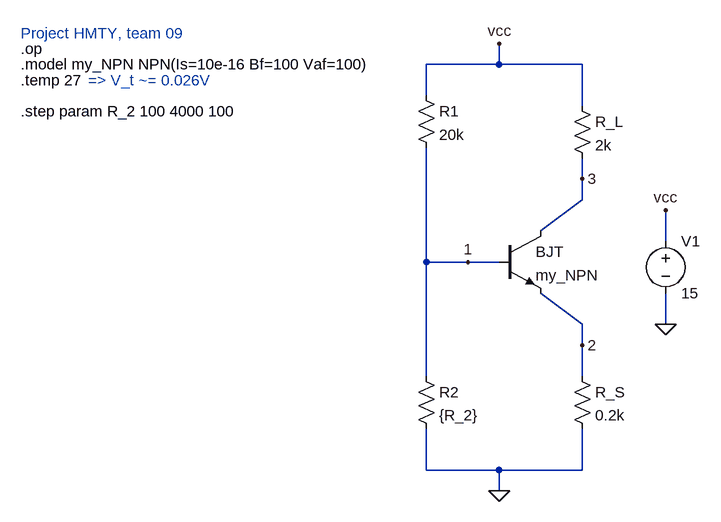
[diagram p0: schematic bjt.asc]
bjt.asc, the LTspice schematic file:
Version 4
SHEET 1 880 680
WIRE 512 -112 512 -144
WIRE 512 -112 400 -112
WIRE 640 -112 512 -112
WIRE 400 -64 400 -112
WIRE 640 -48 640 -112
WIRE 640 64 640 32
WIRE 640 96 640 64
WIRE 576 144 640 96
WIRE 768 160 768 112
WIRE 400 192 400 16
WIRE 464 192 400 192
WIRE 512 192 464 192
WIRE 640 288 576 240
WIRE 768 288 768 240
WIRE 640 320 640 288
WIRE 400 368 400 192
WIRE 640 368 640 320
WIRE 400 512 400 448
WIRE 512 512 400 512
WIRE 640 512 640 448
WIRE 640 512 512 512
WIRE 512 544 512 512
FLAG 512 -144 vcc
FLAG 512 544 0
FLAG 768 288 0
FLAG 768 112 vcc
FLAG 640 320 2
FLAG 640 64 3
FLAG 464 192 1
SYMBOL npn 512 144 R0
SYMATTR InstName BJT
SYMATTR Value my_NPN
SYMBOL res 384 -80 R0
SYMATTR InstName R1
SYMATTR Value 20k
SYMBOL res 384 352 R0
SYMATTR InstName R2
SYMATTR Value {R_2}
SYMBOL res 624 -64 R0
SYMATTR InstName R_L
SYMATTR Value 2k
SYMBOL res 624 352 R0
SYMATTR InstName R_S
SYMATTR Value 0.2k
SYMBOL voltage 768 144 R0
WINDOW 123 0 0 Left 0
WINDOW 39 0 0 Left 0
SYMATTR InstName V1
SYMATTR Value 15
TEXT -224 -160 Left 2 ;Project HMTY, team 09
TEXT -224 -136 Left 2 !.op
TEXT -224 -112 Left 2 !.model my_NPN NPN(Is=10e-16 Bf=100 Vaf=100)
TEXT -224 -88 Left 2 !.temp 27
TEXT -120 -88 Left 2 ;=> V_t ~= 0.026V
TEXT -224 -40 Left 2 !.step param R_2 100 4000 100

The netlist it stands for:
* bjt.asc
Q§BJT 3 1 2 0 my_NPN
R1 vcc 1 20k
R2 1 0 {R_2}
R_L vcc 3 2k
R_S 2 0 0.2k
V1 vcc 0 15
.model NPN NPN
.model PNP PNP
.lib standard.bjt
* Project HMTY, team 09
.op
.model my_NPN NPN(Is=10e-16 Bf=100 Vaf=100)
.temp 27
* => V_t ~= 0.026V
.step param R_2 100 4000 100
.backanno
.end